# EAGLE design wearable_button (EAGLE 9.6.2)
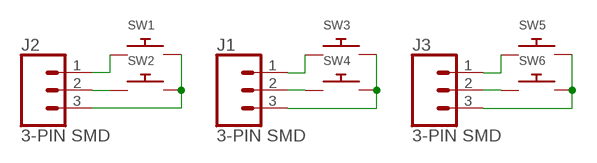
[diagram p0: schematic, sheet 1]

## Parts
J1  3-PIN SMD  CONN_03JST-SMD  [JST-3-SMD]
J2  3-PIN SMD  CONN_03JST-SMD  [JST-3-SMD]
J3  3-PIN SMD  CONN_03JST-SMD  [JST-3-SMD]
SW1  SWITCH_PUSHBUTTONSOFTTOUCHSMD_SJ  [PUSHBUTTON_SMD_SJ]
SW2  SWITCH_PUSHBUTTONSOFTTOUCHSMD_SJ  [PUSHBUTTON_SMD_SJ]
SW3  SWITCH_PUSHBUTTONSOFTTOUCHSMD_SJ  [PUSHBUTTON_SMD_SJ]
SW4  SWITCH_PUSHBUTTONSOFTTOUCHSMD_SJ  [PUSHBUTTON_SMD_SJ]
SW5  SWITCH_PUSHBUTTONSOFTTOUCHSMD_SJ  [PUSHBUTTON_SMD_SJ]
SW6  SWITCH_PUSHBUTTONSOFTTOUCHSMD_SJ  [PUSHBUTTON_SMD_SJ]

## Nets
N$1: J2.2 SW2.P$1
N$2: J2.1 SW1.P$1
N$3: J1.1 SW3.P$1
N$4: J1.2 SW4.P$1
N$5: J2.3 SW1.P$2 SW2.P$2
N$6: J1.3 SW3.P$2 SW4.P$2
N$7: J3.3 SW5.P$2 SW6.P$2
N$8: J3.1 SW5.P$1
N$9: J3.2 SW6.P$1

## Library data of the parts
J1-J3 = SparkFun-Connectors:CONN_03: Multi connection point. Often used as Generic Header-pin footprint for 0.1 inch spaced/style header connections On any of the 0.1 inch spaced packages, you can populate with these: Break Away Headers - Straight <https://www.sparkfun.com/products/116> (PRT-00116) Break Away Male Headers - Right Angle <https://www.sparkfun.com/products/553> (PRT-00553) Female Headers <https://www.sparkfun.com/products/115> (PRT-00115) Break Away Headers - Machine Pin <https://www.sparkfun.com/products/117> (PRT-00117) Break Away Female Headers - Swiss Machine Pin <https://www.sparkfun.com/products/743> (PRT-00743) Stackable Header - 3 Pin (Female, 0.1") <https://www.sparkfun.com/products/13875> (PRT-13875) For SCREWTERMINALS and SPRING TERMINALS visit here: Screw Terimnals on SparkFun.com <https://www.sparkfun.com/search/results?term=Screw+Terminals> (5mm/3.5mm/2.54mm spacing) This device is also useful as a general connection point to wire up your design to another part of your project. Our various solder wires solder well into these plated through hole pads. Hook-Up Wire - Assortment (Stranded, 22 AWG) <https://www.sparkfun.com/products/11375> (PRT-11375) Hook-Up Wire - Assortment (Solid Core, 22 AWG) <https://www.sparkfun.com/products/11367> (PRT-11367) View the entire wire category on our website here <https://www.sparkfun.com/categories/141> Special notes: Molex polarized connector foot print use with SKU : PRT-08232 with associated crimp pins and housings.; PROD_ID: CONN-12591
SW1-SW6 = adafruit:SWITCH_PUSHBUTTON: Buttons SOFTTOUCHSMD_SJ - Soft touch temporary push button (Super Junk Akihabara) Compatible with SKPMANE010 [Mouser: 688-SKPMAN] C&K_KSS = Digikey: KSS221GLFS

## Board
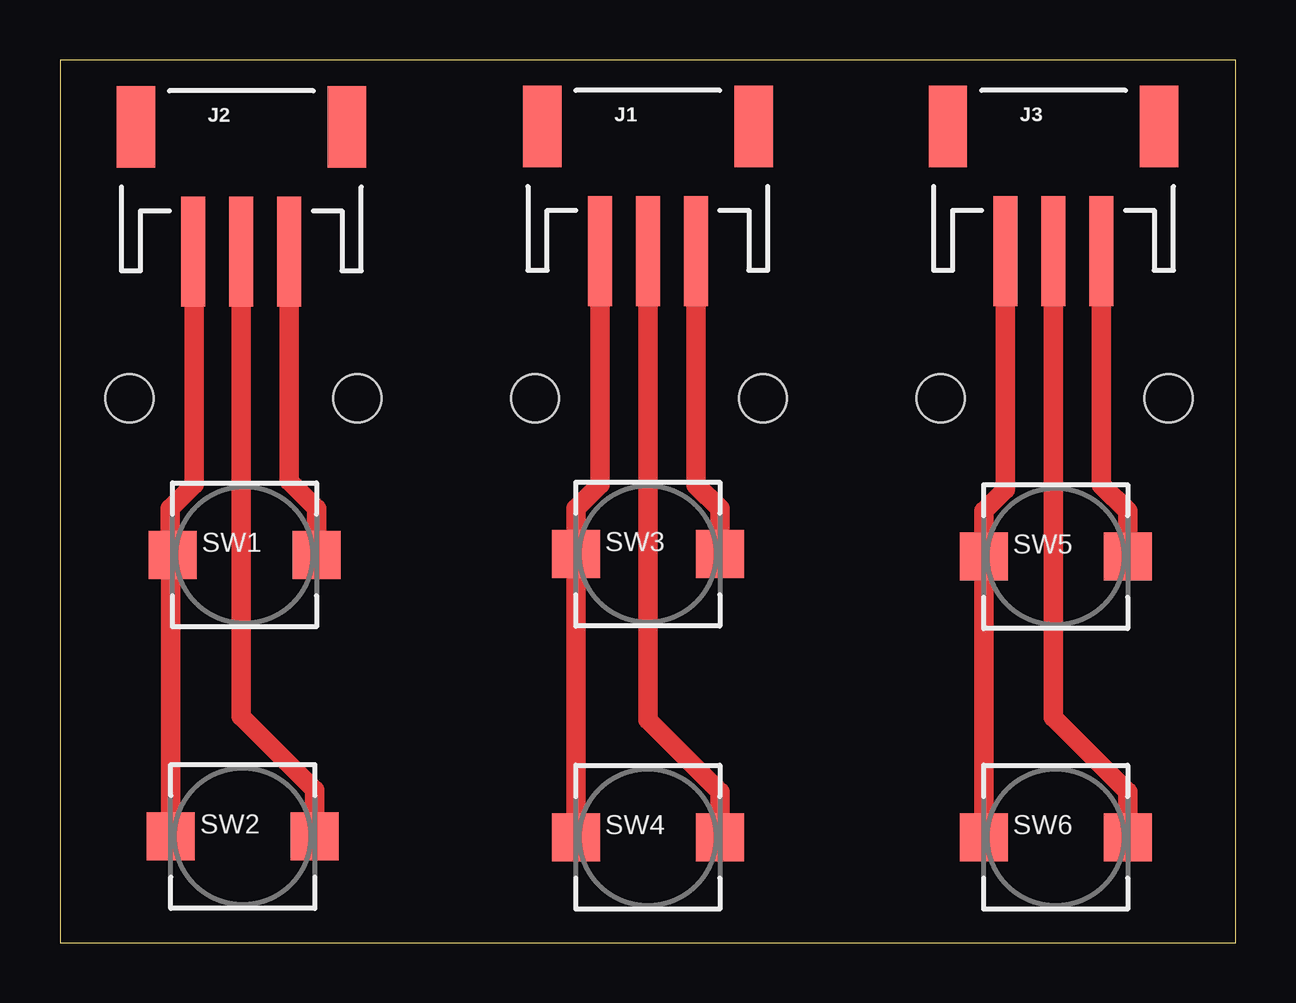
[diagram p1: board, top side]

Size 49 x 36.8 mm. Coordinates in mm from the lower left corner, seen from the top.
Outline: 0,0 49,0 49,36.8 0,36.8 0,0
Copper layers (1*16): Top 0.035mm / dielectric 1.5mm / Bottom 0.035mm
Design rules "default": minimum track width 6mil, minimum drill 0.35mm, track to track 6mil, track to pad 6mil, pad to pad 6mil, via to via 6mil, smd to smd 6mil, copper to edge 40mil, drill to drill 6mil, minimum pad ring 10mil, minimum via ring 8mil, stop-mask expansion 4mil, vias tented up to drill 0mil, thermal gap 10mil
Holes 2 mm at 2.9,22.7 12.4,22.7 19.8,22.7 29.3,22.7 36.7,22.7 46.2,22.7

### Footprints (pad centres in the part's own frame; a part is rotated, then mirrored left to right if it is on the bottom)
JST-3-SMD = smd 1 x 4.6: 1 2.01,-4.77; 2 0.01,-4.77; 3 -1.99,-4.77 | smd 1.6 x 3.4: NC1 -4.39,0.43; NC2 4.41,0.43
PUSHBUTTON_SMD_SJ = smd 2 x 2: P$1 3,0; P$2 -3,0

### Placement (x,y rotation side)
J1  24.5,33.6 0 top
J2  7.55,33.58 0 top
J3  41.4,33.6 0 top
SW1  7.69,16.17 0 top
SW2  7.62,4.43 0 top
SW3  24.5,16.2 0 top
SW4  24.5,4.4 0 top
SW5  41.5,16.1 0 top
SW6  41.5,4.4 0 top

### Tracks (layer width: path | path; a pad name or v marks a point on that pad's centre or on a via)
N$1
  Top 0.61: 7.6,28.77 J2.2
  Top 0.813: J2.2 7.56,9.44 10.62,6.38 SW2.P$1
N$2
  Top 0.61: SW1.P$1
  Top 0.813: J2.1 9.56,19.24 10.7,18.1 SW1.P$1
N$3
  Top 0.813: J1.1 26.51,19.09 27.5,18.1 SW3.P$1
N$4
  Top 0.813: J1.2 24.51,9.29 27.5,6.3 SW4.P$1
N$5
  Top 0.61: 4.62,16.1 SW1.P$2 4.6,16.26 | 5.6,28.77 J2.3
  Top 0.813: SW2.P$2 4.62,16.1 | 4.6,16.26 4.6,18.1 5.6,19.1 5.6,28.77
N$6
  Top 0.813: SW4.P$2 SW3.P$2 21.5,18.1 22.51,19.11 J1.3
N$7
  Top 0.813: SW6.P$2 SW5.P$2 38.5,18 39.4,18.9 J3.3
N$8
  Top 0.813: J3.1 43.41,19.09 44.5,18 SW5.P$1
N$9
  Top 0.813: J3.2 41.41,9.39 44.5,6.3 SW6.P$1